# EasyEDA schematic SCH_Distance sensor with LED PWM_2022-05-23.json
TITLE: Ultrasonic-sensor PWM LED; REV: 1.0; Date: 2022-05-19; Sheet: 1/1; Drawn By: Shakwat Limon; Company: Shakwat Limon
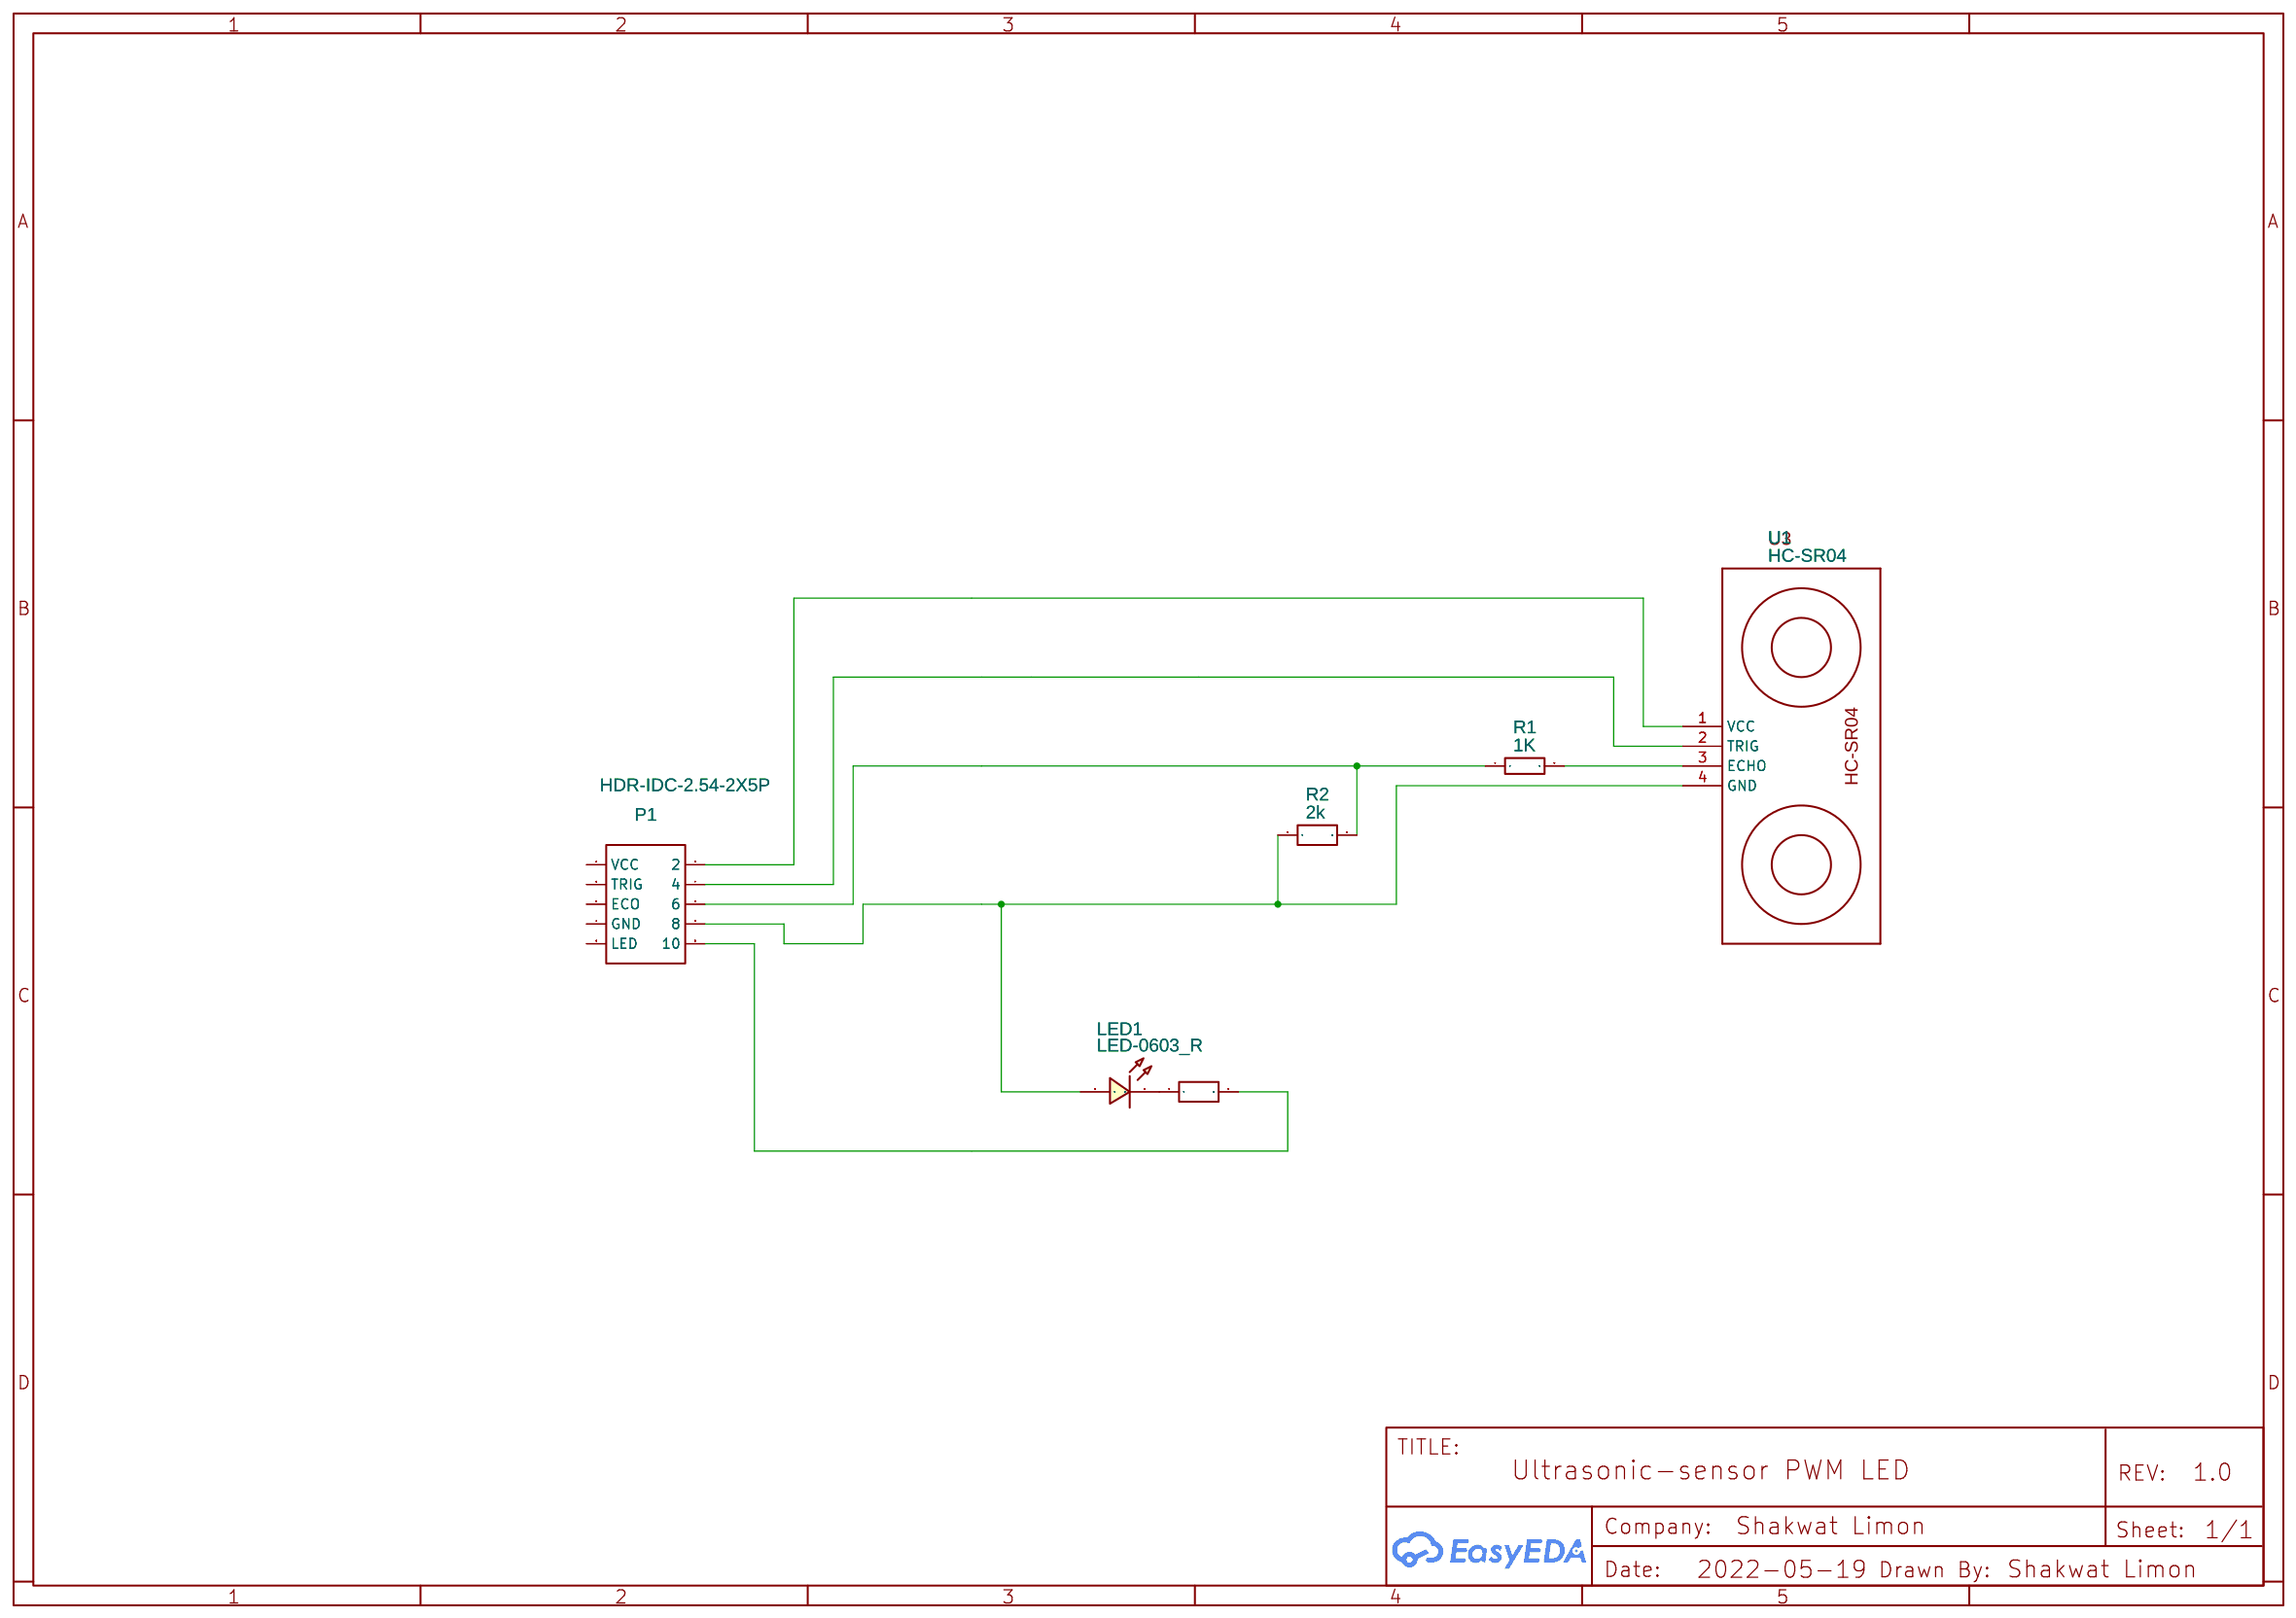
[diagram p0: schematic sheet]

## Parts
LED1  LED-0603_R  [LED0603_RED]
P1  HDR-IDC-2.54-2X5P  [IDC-TH_10P-P2.54_C5665]
R1  1K  [RESISTOR 1K OHM]
R2  2k  [R0603]
R3  1k  [R0603]
U1  HC-SR04  [HC-SR04]

## Library data of the parts
LED1 = LED-0603_R: Manufacturer: EVERLIGHT(台湾亿光); Manufacturer Part: 19-217/R6C-AL1M2VY/3T; Supplier Part: C72044; Supplier: LCSC; Contributor: LCEDA_01
P1 = HDR-IDC-2.54-2X5P: Supplier: LCSC; Manufacturer: BOOMELE; Manufacturer Part: IDC Box 2.54mm 2X5P; image: //image.lceda.cn/szlcsc/C5665.jpg; Supplier Part: C5665
R1 = resistor 1k ohm: Supplier: LCSC; Supplier Part: C348856; Manufacturer: ResistorToday; Manufacturer Part: EWWR0003J1K00T9; Contributor: sg lee; JLCPCB Part Class: Extended Part
R2 R3 = R_0603_EU: Contributor: LCEDA_Lib
U1 = HC-SR04: Manufacturer Part: ServoMotor; Contributor: srimbey

## Nets
Net-(LED1-1): LED1.1 P1.8 R2.1 U1.4(GND)
Net-(LED1-2): LED1.2 R3.1
Net-(P1-2): P1.2 U1.1(VCC)
Net-(P1-4): P1.4 U1.2(TRIG)
Net-(P1-6): P1.6 R1.1 R2.2
Net-(P1-10): P1.10 R3.2
Net-(R1-2): R1.2 U1.3(ECHO)

Not connected (* = marked no-connect by the designer): P1 1(VCC) 3(TRIG) 5(ECO) 7(GND) 9(LED)
